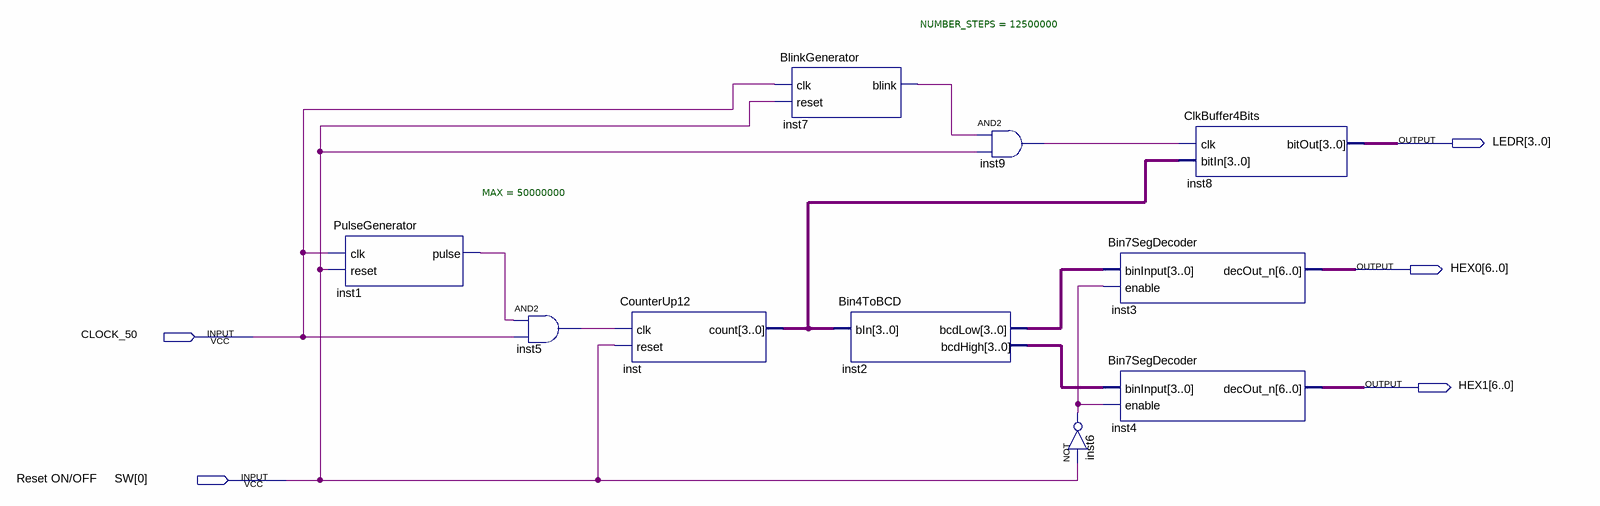
[diagram p0: schematic sheet]
// Quartus schematic projetoTreino2.bdf as structural Verilog: 10 symbols, 5 pins
module projetoTreino2 (
  input  CLOCK_50,
  input  [0:0] SW,
  output [3:0] LEDR,
  output [6:0] HEX0,
  output [6:0] HEX1
);

  wire inst1_pulse, inst5_out, inst6_out, inst7_blink, inst9_out;
  wire [3:0] inst2_bcdhigh, inst2_bcdlow, inst_count;

  PulseGenerator #(.MAX(50000000)) inst1 (.clk(CLOCK_50), .reset(SW[0]), .pulse(inst1_pulse));
  and inst5 (inst5_out, inst1_pulse, CLOCK_50);
  CounterUp12 inst (.clk(inst5_out), .reset(SW[0]), .count(inst_count));
  BlinkGenerator #(.NUMBER_STEPS(12500000)) inst7 (.clk(CLOCK_50), .reset(SW[0]), .blink(inst7_blink));
  Bin4ToBCD inst2 (.bIn(inst_count), .bcdLow(inst2_bcdlow), .bcdHigh(inst2_bcdhigh));
  and inst9 (inst9_out, inst7_blink, SW[0]);
  not inst6 (inst6_out, SW[0]);
  Bin7SegDecoder inst3 (.binInput(inst2_bcdlow), .enable(inst6_out), .decOut_n(HEX0));
  Bin7SegDecoder inst4 (.binInput(inst2_bcdhigh), .enable(inst6_out), .decOut_n(HEX1));
  ClkBuffer4Bits inst8 (.clk(inst9_out), .bitIn(inst_count), .bitOut(LEDR));

  // Notes on the sheet:
  //   Reset ON/OFF
endmodule
